# EAGLE design Xadow-GPS-v2 (EAGLE 6.4)
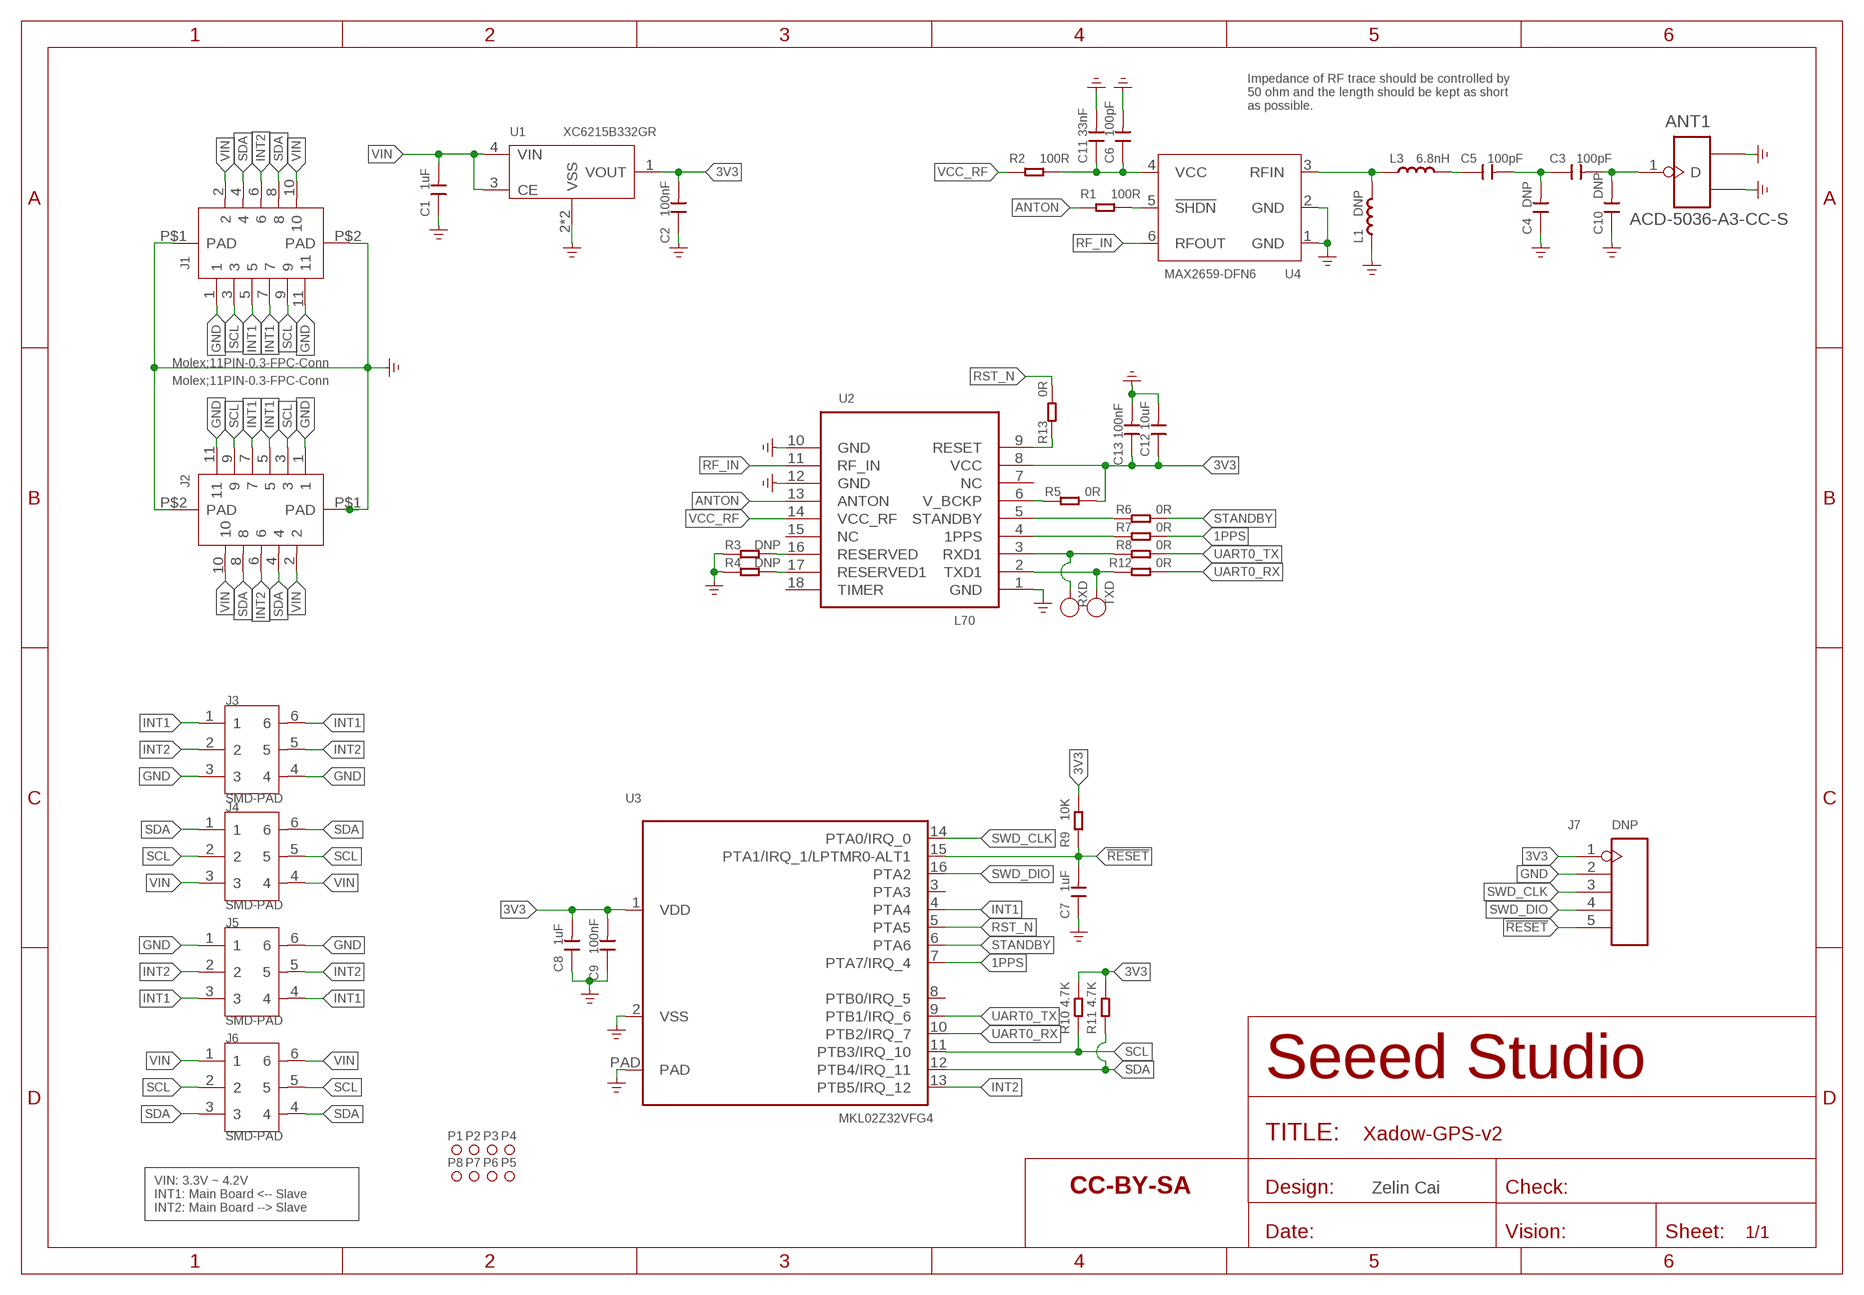
[diagram p0: schematic, sheet 1]

## Parts
ANT1  ACD-5036-A3-CC-S  ANTENNA-ACD5036  [ANT3-SMD-5.2X3.7X0.7MM]
C1  1uF  CAP-0402  [C0402]
C2  100nF  CAP-0201  [C0201]
C3  100pF  CAP-0201  [C0201]
C4  DNP  CAP-0201  [C0201]
C5  100pF  CAP-0201  [C0201]
C6  100pF  CAP-0201  [C0201]
C7  1uF  CAP-0201  [C0201]
C8  1uF  CAP-0402  [C0402]
C9  100nF  CAP-0201  [C0201]
C10  DNP  CAP-0201  [C0201]
C11  33nF  CAP-0201  [C0201]
C12  10uF  CAP-0402  [C0402]
C13  100nF  CAP-0201  [C0201]
FR  PAGE1  SEEEDSTUDIO-OPEN-SCH-FRAME  [SEEEDSTUDIO-PCB-FRAME]
J1  Molex;11PIN-0.3-FPC-Conn  FPC-CONNECTER-11P(FH35C-11S-0.3SHW(50))  [FPC11-SMD-0.3(FH35C)]
J2  Molex;11PIN-0.3-FPC-Conn  FPC-CONNECTER-11P(FH35C-11S-0.3SHW(50))  [FPC11-SMD-0.3(FH35C)]
J3  SMD-PAD  HEADER6_ROUND  [6P-DIP-2_ROUND]
J4  SMD-PAD  HEADER6  [6P-DIP-2]
J5  SMD-PAD  HEADER6_ROUND  [6P-DIP-2_ROUND]
J6  SMD-PAD  HEADER6_S3  [6P-DIP-2_S3]
J7  DNP  HEADER-5P'TEST'  [H5-SMD-2.0-TEST]
L1  DNP  INDUCTOR/FERRITE-BEAD-0201  [L0201]
L3  6.8nH  INDUCTOR/FERRITE-BEAD-0201  [L0201]
P1  MRK  MARK-1.0'ANNULAR'  [ROUND-MARK-1.0]
P2  MRK  MARK-1.0'ANNULAR'  [ROUND-MARK-1.0]
P3  MRK  MARK-1.0'ANNULAR'  [ROUND-MARK-1.0]
P4  MRK  MARK-1.0'ANNULAR'  [ROUND-MARK-1.0]
P5  MRK  MARK-1.0'ANNULAR'  [ROUND-MARK-1.0]
P6  MRK  MARK-1.0'ANNULAR'  [ROUND-MARK-1.0]
P7  MRK  MARK-1.0'ANNULAR'  [ROUND-MARK-1.0]
P8  MRK  MARK-1.0'ANNULAR'  [ROUND-MARK-1.0]
R1  100R  RES-0201  [R0201]
R2  100R  RES-0201  [R0201]
R3  DNP  RES-0201  [R0201]
R4  DNP  RES-0201  [R0201]
R5  0R  RES-0201  [R0201]
R6  0R  RES-0201  [R0201]
R7  0R  RES-0201  [R0201]
R8  0R  RES-0201  [R0201]
R9  10K  RES-0201  [R0201]
R10  4.7K  RES-0201  [R0201]
R11  4.7K  RES-0201  [R0201]
R12  0R  RES-0201  [R0201]
R13  0R  RES-0201  [R0201]
RXD  RXD  TEST-POINT'4545'  [TP-D45MIL]
TXD  TXD  TEST-POINT'4545'  [TP-D45MIL]
U1  XC6215B332GR  PMIC-XC6215-3V3  [USP4-0.6-1.2X1.6MM]
U2  L70  MOUDLE-GPS-L70-HARDWARE  [LGA18-1.1-9.7X10.1X2.5MM]
U3  MKL02Z32VFG4  CONTROLLER-MKL02ZXXVFG4  [QFN16G-0.5-3X3MM]
U4  MAX2659-DFN6  AMPLIFIER-MAX2659  [DFN6-0.5-1.5X1.2X0.72MM]

## Nets
1PPS: R7.1 U3.7(PTA7/IRQ_4)
3V3: C2.2 C8.2 C9.2 C12.1 C13.1 J7.1 R5.1 R9.2 R10.2 R11.2 U1.1(VOUT) U2.8(VCC) U3.1(VDD)
!RESET: C7.2 J7.5 R9.1 U3.15(PTA1/IRQ_1/LPTMR0-ALT1)
ANTON: R1.2 U2.13(ANTON)
GND: ANT1.2(GND1) ANT1.3(GND2) C1.1 C2.1 C4.1 C6.2 C7.1 C8.1 C9.1 C10.1 C11.2 C12.2 C13.2 J1.1 J1.11 J1.P$1(PAD) J1.P$2(PAD) J2.1 J2.11 J2.P$1(PAD) J2.P$2(PAD) J3.3 J3.4 J5.1 J5.6 J7.2 L1.1 R3.2 R4.2 U1.2(VSS) U1.PAD(VSS) U2.1(GND) U2.10(GND) U2.12(GND) U3.2(VSS) U3.PAD U4.1(GND) U4.2(GND) ; supply symbol labelled GND_POWER
INT1: J1.5 J1.7 J2.5 J2.7 J3.1 J3.6 J5.3 J5.4 U3.4(PTA4)
INT2: J1.6 J2.6 J3.2 J3.5 J5.2 J5.5 U3.13(PTB5/IRQ_12)
N$1: C3.1 C4.2 C5.2
N$2: ANT1.1(D) C3.2 C10.2
N$3: L1.2 L3.1 U4.3(RFIN)
N$4: C5.1 L3.2
N$5: R1.1 U4.5(!SHDN)
N$6: C6.1 C11.1 R2.1 U4.4(VCC)
N$7: R3.1 U2.16(RESERVED)
N$8: R4.1 U2.17(RESERVED1)
N$9: R5.2 U2.6(V_BCKP)
N$10: R6.2 U2.5(STANDBY)
N$11: R7.2 U2.4(1PPS)
N$12: R13.2 U2.9(RESET)
RF_IN: U2.11(RF_IN) U4.6(RFOUT)
RST_N: R13.1 U3.5(PTA5)
RXD1: R8.2 RXD.T U2.3(RXD1)
SCL: J1.3 J1.9 J2.3 J2.9 J4.2 J4.5 J6.2 J6.5 R10.1 U3.11(PTB3/IRQ_10)
SDA: J1.4 J1.8 J2.4 J2.8 J4.1 J4.6 J6.3 J6.4 R11.1 U3.12(PTB4/IRQ_11)
STANDBY: R6.1 U3.6(PTA6)
SWD_CLK: J7.3 U3.14(PTA0/IRQ_0)
SWD_DIO: J7.4 U3.16(PTA2)
TXD1: R12.2 TXD.T U2.2(TXD1)
UART0_RX: R12.1 U3.10(PTB2/IRQ_7)
UART0_TX: R8.1 U3.9(PTB1/IRQ_6)
VCC_RF: R2.2 U2.14(VCC_RF)
VIN: C1.2 J1.2 J1.10 J2.2 J2.10 J4.3 J4.4 J6.1 J6.6 U1.3(CE) U1.4(VIN)
Unconnected: U2.7(NC) U2.15(NC) U2.18(TIMER) U3.3(PTA3) U3.8(PTB0/IRQ_5)

## Notes on the sheet
- Impedance of RF trace should be controlled by 
  50 ohm and the length should be kept as short 
  as possible.
- Zelin Cai
- VIN: 3.3V ~ 4.2V
  INT1: Main Board <-- Slave
  INT2: Main Board --> Slave

## Library data of the parts
ANT1 = Connector-new:ANTENNA-ACD5036; MPN: ACD-5036-A3-CC-S
C1-C13 = Discrete-new:CAP: Ceramic Capacitors
FR = moudle-new:SEEEDSTUDIO-OPEN-SCH-FRAME
J1 J2 = template:FPC-CONNECTER-11P(FH35C-11S-0.3SHW(50))
J3 J5 = template:HEADER6_ROUND
J4 = template:HEADER6
J6 = Connector:HEADER6_S3
J7 = Connector-new:HEADER-5P
L1 L3 = Discrete-new:INDUCTOR/FERRITE-BEAD
P1-P8 = Discrete-new:MARK-1.0; PARTNO: DNP
R1-R13 = Discrete-new:RES
RXD TXD = Discrete-new:TEST-POINT; PARTNO: DNP
U1 = IC-new:PMIC-XC6215-3V3
U2 = moudle-new:MOUDLE-GPS-L70-HARDWARE: L70 GPS module; MPN: L70
U3 = IC-new:CONTROLLER-MKL02ZXXVFG4; MPN: MKL02ZxxVFG4
U4 = IC-new:AMPLIFIER-MAX2659: GPS/GNSS Low-Noise Amplifier; MPN: MAX2659

## Board
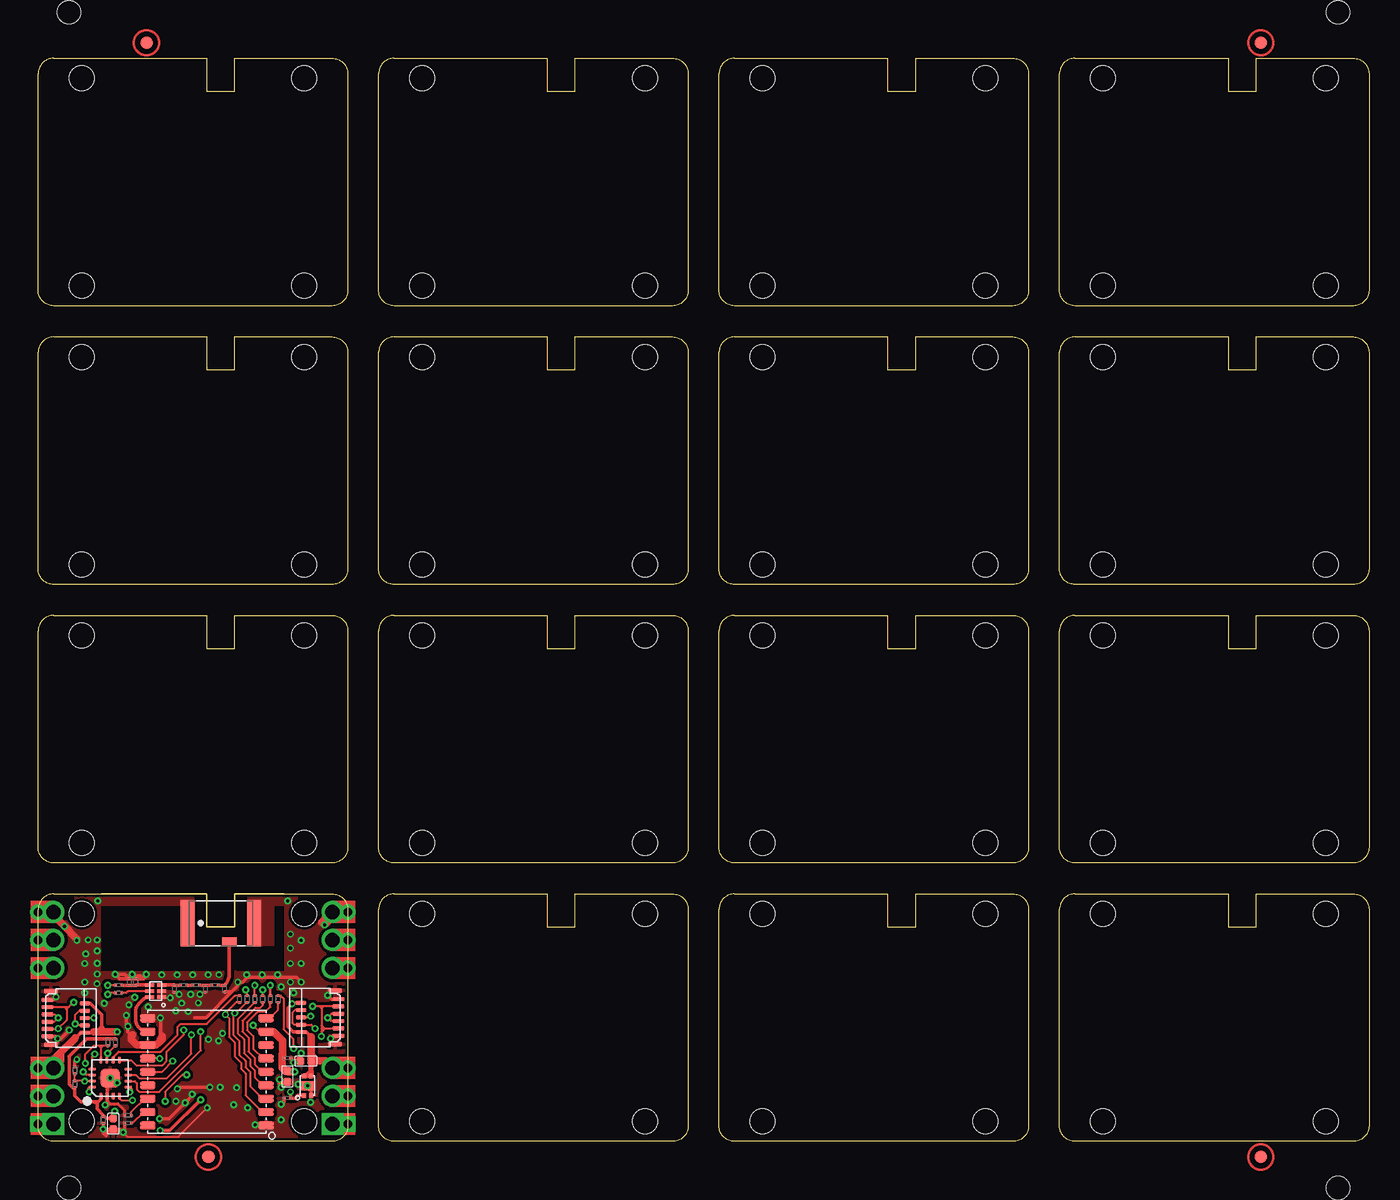
[diagram p1: board, top side]
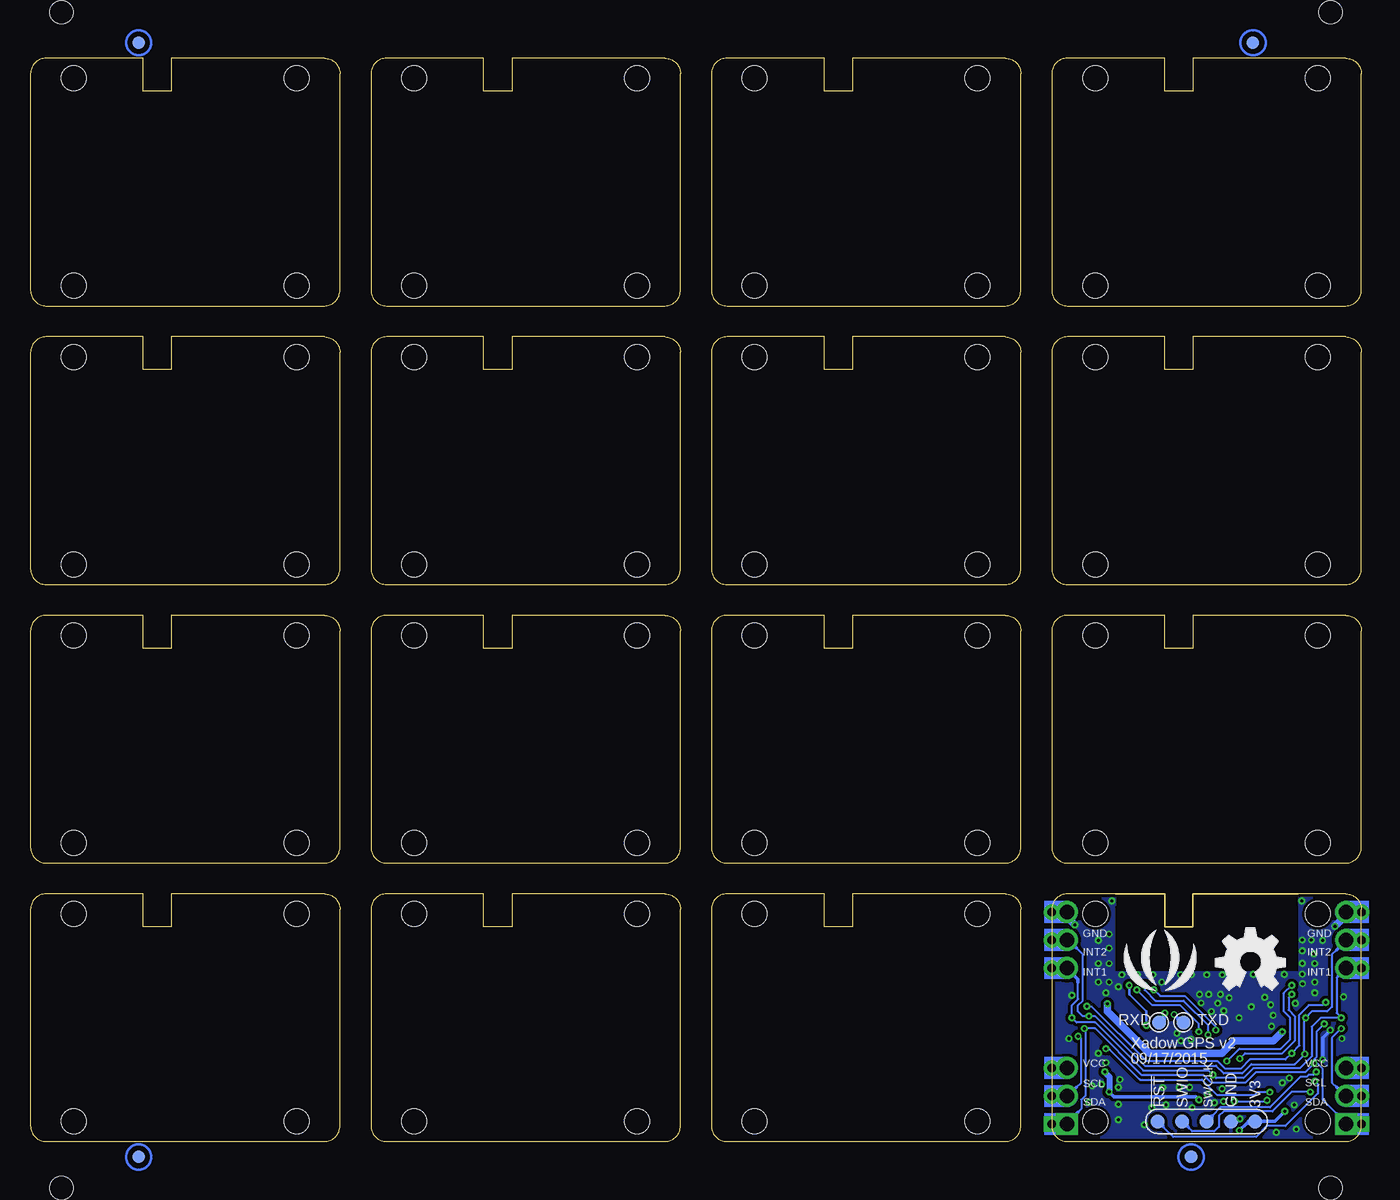
[diagram p2: board, bottom side, seen from below]

Size 109.22 x 88.9 mm. Coordinates in mm from the lower left corner, seen from the top.
Outline: 600 segments
Copper layers (1*16): Top 0.035mm / dielectric 1.5mm / Bottom 0.035mm
Design rules "SeeedStudio_2layer_DRU_no_angle_20140221 *": minimum track width 1mil, minimum drill 10mil, track to track 6mil, track to pad 6mil, pad to pad 6mil, via to via 6mil, smd to smd 0mil, copper to edge 10mil, drill to drill 10mil, minimum pad ring 10mil, minimum via ring 6mil, stop-mask expansion 2mil, vias tented up to drill 25mil, thermal gap 10mil
Holes 2.03 mm at 21.84,1.65 3.56,18.67 21.84,18.67 3.56,1.65 3.56,18.67 21.84,18.67 21.84,1.65 3.56,1.65 49.78,1.65 49.78,18.67 31.5,18.67 31.5,1.65 21.84,24.51 21.84,41.53 3.56,41.53 3.56,24.51 49.78,24.51 49.78,41.53 31.5,41.53 31.5,24.51 77.72,1.65 77.72,18.67 59.44,18.67 59.44,1.65 105.66,1.65 105.66,18.67 87.38,18.67 87.38,1.65 77.72,24.51 77.72,41.53 59.44,41.53 59.44,24.51 105.66,24.51 105.66,41.53 87.38,41.53 87.38,24.51 21.84,47.37 21.84,64.39 3.56,64.39 3.56,47.37 49.78,47.37 49.78,64.39 31.5,64.39 31.5,47.37 21.84,70.23 21.84,87.25 3.56,87.25 3.56,70.23 49.78,70.23 49.78,87.25 31.5,87.25 31.5,70.23 77.72,47.37 77.72,64.39 59.44,64.39 59.44,47.37 105.66,47.37 105.66,64.39 87.38,64.39 87.38,47.37 77.72,70.23 77.72,87.25 59.44,87.25 59.44,70.23 105.66,70.23 105.66,87.25 87.38,87.25 87.38,70.23
Holes 1.91 mm at 2.54,-3.81 106.68,-3.81 106.68,92.71 2.54,92.71
bRestrict: 2 lines

### Footprints (pad centres in the part's own frame; a part is rotated, then mirrored left to right if it is on the bottom)
ANT3-SMD-5.2X3.7X0.7MM = smd 0.75 x 1.2: 1 1.525,0.7 | smd 3.8 x 1.15: 2 0,2.725; 3 0,-2.725
C0402 = smd 0.635 x 0.635: 1 0,0.445; 2 0,-0.445
C0201 = smd 0.279 x 0.318: 1 -0.279,0; 2 0.279,0
FPC11-SMD-0.3(FH35C) = smd 0.3 x 1: 1 -1.5,-3.075; 3 -0.9,-3.075; 5 -0.3,-3.075; 7 0.3,-3.075; 9 0.9,-3.075; 11 1.5,-3.075 | smd 0.3 x 0.85: 2 -1.2,0; 4 -0.6,0; 6 0,0; 8 0.6,0; 10 1.2,0 | smd 0.4 x 1.15: P$1 2.2,-2.8; P$2 -2.2,-2.8
6P-DIP-2_ROUND = drill 0.7 pad 1.27: 1 -2.3,0; 2 0,0; 3 2.3,0 | drill 1.2 pad 1.8: 4 2.3,1.25; 5 0,1.25; 6 -2.3,1.25
6P-DIP-2 = drill 0.7 pad 1.27 square: 1 -2.3,0 | drill 0.7 pad 1.27: 2 0,0; 3 2.3,0 | drill 1.2 pad 1.8: 4 2.3,1.25; 5 0,1.25 | drill 1.2 pad 1.8 square: 6 -2.3,1.25
6P-DIP-2_S3 = drill 0.7 pad 1.27: 1 -2.3,0; 2 0,0 | drill 0.7 pad 1.27 square: 3 2.3,0 | drill 1.2 pad 1.8 square: 4 2.3,1.25 | drill 1.2 pad 1.8: 5 0,1.25; 6 -2.3,1.25
H5-SMD-2.0-TEST = smd 1.143 x 1.143: 1 0,4; 2 0,2; 3 0,0; 4 0,-2; 5 0,-4
L0201 = smd 0.279 x 0.318: 1 -0.279,0; 2 0.279,0
ROUND-MARK-1.0 = smd 1.016 x 1.016: P$1 0,0
R0201 = smd 0.279 x 0.318: 1 -0.279,0; 2 0.279,0
TP-D45MIL = smd 1.143 x 1.143: T 0,0
USP4-0.6-1.2X1.6MM = smd 0.36 x 0.4: 1 -0.3,-0.8; 2 0.3,-0.8; 3 0.3,0.8; 4 -0.3,0.8 | smd 1 x 0.7: PAD 0,0
LGA18-1.1-9.7X10.1X2.5MM = smd 1.27 x 0.635: 1 4.85,-4.4; 2 4.85,-3.3; 3 4.85,-2.2; 4 4.85,-1.1; 5 4.85,0; 6 4.85,1.1; 7 4.85,2.2; 8 4.85,3.3; 9 4.85,4.4; 10 -4.85,4.4; 11 -4.85,3.3; 12 -4.85,2.2; 13 -4.85,1.1; 14 -4.85,0; 15 -4.85,-1.1; 16 -4.85,-2.2; 17 -4.85,-3.3; 18 -4.85,-4.4
QFN16G-0.5-3X3MM = smd 0.6 x 0.25: 1 -1.475,0.75; 2 -1.475,0.25; 3 -1.475,-0.25; 4 -1.475,-0.75; 9 1.475,-0.75; 10 1.475,-0.25; 11 1.475,0.25; 12 1.475,0.75 | smd 0.25 x 0.6: 5 -0.75,-1.475; 6 -0.25,-1.475; 7 0.25,-1.475; 8 0.75,-1.475; 13 0.75,1.475; 14 0.25,1.475; 15 -0.25,1.475; 16 -0.75,1.475 | smd 1.6 x 1.6: PAD 0,0
DFN6-0.5-1.5X1.2X0.72MM = smd 0.3 x 0.75: 1 -0.5,-0.5; 2 0,-0.5; 3 0.5,-0.5; 4 0.5,0.5; 5 0,0.5; 6 -0.5,0.5

### Placement (x,y rotation side)
ANT1  14.99,17.92 270 top
C1  21.97,6.6 90 top
C2  20.45,3.56 0 top
C3  14.5,12.83 0 top
C4  13.72,12.55 90 top
C5  12.95,12.83 0 top
C6  8,13.08 90 top
C7  3.01,5.84 270 top
C8  6.16,1.46 180 top
C9  5.33,1.78 90 top
C10  15.29,12.55 90 top
C11  7.49,13.08 90 top
C12  20.45,5.33 0 top
C13  20.45,6.86 0 top
FR  12.32,-30.1 0 top  (outside the outline)
J1  21.56,10.19 90 top
J2  3.84,10.13 270 top
J3  25.4,16.54 90 top
J4  25.4,3.73 90 top
J5  0,16.54 270 top
J6  0,3.73 270 top
J7  12.7,1.65 270 bottom
L1  11.18,12.55 90 top
L3  11.94,12.83 0 top
P1  13.97,-1.27 0 top
P2  13.97,-1.27 0 bottom
P3  8.89,90.17 0 top
P4  8.89,90.17 0 bottom
P5  100.33,-1.27 0 top
P6  100.33,-1.27 0 bottom
P7  100.33,90.17 0 top
P8  100.33,90.17 0 bottom
R1  6.6,12.19 180 top
R2  6.6,12.83 180 top
R3  7.37,2.16 180 top
R4  7.37,1.52 180 top
R5  19.05,11.68 270 top
R6  18.41,11.68 270 top
R7  17.78,11.68 270 top
R8  17.14,11.68 270 top
R9  3.01,4.7 270 top
R10  6.35,8.13 90 top
R11  5.71,8.13 90 top
R12  16.51,11.68 270 top
R13  19.68,11.68 270 top
RXD  16.61,9.78 180 bottom
TXD  14.61,9.78 180 bottom
U1  22.1,4.57 0 top
U2  13.84,5.71 0 top
U3  5.91,5.21 90 top
U4  9.64,12.34 90 top
U$19  [OSHW_FILLX200_NOTEXT]  11.94,12.45 0 bottom
U$21  [SEEED-SILK-280*268MIL]  16.51,14.1 0 bottom

### Tracks (layer width: path | path; a pad name or v marks a point on that pad's centre or on a via)
1PPS  (via drill 0.25 pad 0.51)
  Top 0.152: U3.7 8.02,5.46 8.31,5.17 10.53,5.17 12.57,7.21 v12.57,8.76 | R7.1 v17.78,12.83
  Bottom 0.152: v17.78,12.83 17.78,12.45 16.89,11.56 14.61,11.56 12.57,9.53 v12.57,8.76
3V3  (via drill 0.25 pad 0.51)
  Top 0.203: R5.1 v19.05,12.83 | U2.8 18.16,9.02 v17.65,9.53
  Top 0.305: v20.7,4.06 20.73,4.04 C2.2 21.08,3.56 21.3,3.77 U1.1 | 20.51,5.71 C12.1 | R10.2 R11.2 3.96,8.41 2.54,6.99 2.54,4.7 2.82,4.42 R9.2 3.01,3.75 3.48,3.28 4.6,3.28 | v13.34,3.43 10.81,0.9 v10.01,0.9 | U2.8 | 4.83,3.05 4.83,2.67 5.33,2.16 C9.2 5.44,2.06 5.59,1.91 C8.2 6.16,2.38 v6.27,2.49 | 4.83,3.05 4.83,3.17 4.93,3.28 | 4.93,3.28 5.16,3.5 U3.1 | 4.6,3.28 4.93,3.28 | 4.6,3.28 4.83,3.05 | 20.07,7.24 20.07,7.16 20.07,6.96 C13.1 | C13.1 19.94,6.86 19.94,7.24 | C13.1 20.17,6.88 20.24,6.96 20.24,7.21 20.19,7.26
  Top 0.61: U2.8 19.31,9.02 20.07,8.26 20.07,7.24 | C12.1 20.31,5.78 20.04,6.04 20.04,7.14 20.07,7.16 | 20.51,5.71 v21.06,5.71
  Bottom 0.203: v19.05,12.83 19.05,12.06 17.65,10.67 v17.65,9.53
  Bottom 0.305: v13.34,3.43 13.59,3.68 20.32,3.68 v20.7,4.06 | v6.27,2.49 7.11,1.65 J7.1 9.26,1.65 9.41,1.49 | 9.41,1.49 v10.01,0.9 | 9.41,1.49 8.67,1.49 8.64,1.52
  Bottom 0.508: 20.7,4.12 v20.7,4.06 20.65,4.12 20.65,5.28 21.08,5.71 v21.06,5.71
!RESET  (via drill 0.25 pad 0.51)
  Top 0.152: U3.15 v3.81,4.96 v3.81,4.95 3.79,4.98 R9.1 C7.2
  Bottom 0.152: 16.19,1.14 15.43,0.38 8.64,0.38 7.75,1.27 6.22,1.27 3.56,3.94 3.56,4.7 v3.81,4.95 | 16.19,1.14 J7.5 | 16.19,1.14 16.26,1.65 | 16.19,1.14 16.76,1.4
ANTON  (via drill 0.25 pad 0.51)
  Top 0.152: U2.13 9.02,6.79 9.02,6.73 8.89,6.86 9.92,6.86 v9.97,6.81 | R1.2 5.84,12.19 v5.71,12.06
  Bottom 0.152: v9.97,6.81 9.54,7.24 6.48,7.24 5.46,8.26 5.46,10.29 5.97,10.79 5.97,11.81 v5.71,12.06
GND  (via drill 0.25 pad 0.51)
  Top 0.152: v6.99,0.76 6.99,0.71 7.32,0.38 11.49,0.38 v13.88,2.77
  Top 0.254: R3.2 7.09,2.56 6.54,3.11 5.91,3.11 | 5.91,3.11 5.7,3.11 5.69,3.1 5.69,3.07 5.71,3.05 5.66,3.05 5.64,3.07 5.64,3.05 5.61,3.02 5.59,3.02 | 5.91,3.11 5.71,3.3
  Top 0.305: v5.33,1.02 C8.1 6.73,1.02 v6.99,0.76 7.09,0.86 R4.2 | U3.PAD 5.66,4.96 U3.2 5.66,3.14 v5.51,3 | J2.11 1.4,8.63 v1.59,8.45 | J2.P$1 1.33,7.93 1.59,8.19 v1.59,8.45 | J2.1 1.22,11.63 v1.46,11.87 1.46,12.13 1.25,12.34 J2.P$2 | 24.15,18.43 J3.4 J3.3 | J1.1 24.24,8.69 v24,8.45 24,8.13 24.15,7.99 J1.P$2 | v19.94,4.45 20.38,4.89 C12.2 20,4.89 | U1.2 22.4,4.14 | 22.4,4.14 22.4,4.27 U1.PAD | v3.17,16.51 3.17,16.64 | C7.1 3.01,6.57 v3.17,6.73 | v1.59,8.45 1.84,8.45 v2.54,9.14 | J1.11 24.07,11.69 v23.75,12 23.75,12.06 24.07,12.38 J1.P$1 | 20.99,6.51 21.08,6.6 C1.1 21.53,7.18 v21.59,7.24 | 20.99,6.51 v20.95,6.48 | C13.2 20.73,6.77 20.99,6.51 | v10.03,10.16 10.03,8.38 9.57,7.92 9.15,7.92 U2.12 | v21.59,13.08 21.21,13.46 17.14,13.46 16.76,13.08 v16.38,13.08 16.38,12.77 15.88,12.27 | C2.1 20.17,3.28 v19.94,3.05 | 22.4,4.14 22.1,4.45 | C6.2 C11.2 | C11.2 7.49,13.49 v7.72,13.72 | C6.2 8,13.46 7.75,13.72 | C10.1 15.88,12.27 | C11.2 6.71,13.36 6.35,13.72 7.11,13.72 7.24,13.59 7.37,13.59 7.37,13.46 7.49,13.34 | C6.2 8.66,13.36 8.76,13.46 8.26,13.46 8.13,13.59 8.38,13.59 | 7.68,8.7 7.37,9.02 v7.37,9.46 7.24,9.59 v7.24,10.35 | v5.33,1.02 5.33,0.89 | 5.33,0.89 5.51,0.71 6.91,0.71 6.99,0.79 | C9.1 v5.33,1.02 | 5.33,0.89 5.33,0.69 5.56,0.46 | 20,4.89 v19.81,5.08 19.81,4.7 20,4.89 | 15.88,12.27 15.88,12.26 13.78,10.16 12.83,10.16 | v14.1,4.45 11.56,4.45 v11.43,4.32 | v9.96,1.85 10.74,1.85 v12.06,3.17 12.64,3.75 v12.64,3.87
  Top 0.61: J5.6 1.25,18.56 v2.16,17.65 3.17,16.64 | 24.15,18.43 v23.5,17.78 23.5,18.29 23.62,18.41 | U2.12 8.09,7.92 7.62,8.38 7.62,8.64 7.75,8.76 | 9.15,7.92 9.69,7.92 10.03,8.26 10.03,8.38 10.16,8.38 10.16,8.64 | 23.62,18.41 24.13,18.92 | 23.62,18.41 23.62,18.34 23.27,17.98
  Bottom 0.305: v2.54,9.14 3.17,8.51 v3.17,6.73 | J7.2 10.16,1.65 v9.96,1.85
  Bottom 0.61: v2.16,17.65 1.27,18.54 1.27,18.82 J5.6 | v23.5,17.78 24.15,18.43 J3.4
  other vias: 22.1,4.57 4.83,12.95 5.91,5.21 6.48,4.83 13.97,8.38 14.92,4.45 15.13,8.89 17.82,1.37 11.56,12.06 3.81,14.61 9.02,11.05 19.94,1.78 20.7,13.08 20.7,14.61 21.59,16.51 3.81,12.19 12.32,10.67 21.59,14.61 3.81,13.08 4.85,15.65 4.85,14.63 4.85,13.74 6.32,13.72 8.86,13.72 10.13,13.69 11.4,13.69 12.67,13.69 13.94,13.69 14.83,13.69 17.12,13.69 18.39,13.69 19.66,13.69 20.7,15.88 7.44,11.21 7.92,11.82 13.14,11.37 20.7,17.02 10.85,11.79 12.51,12.06 4.88,19.74 20.47,19.74 5.41,11.33 11.79,11.35 11.28,10.72 14.8,8.26 20.95,12.19 19.94,12.7 16.04,3.02 22.35,3.23 21.34,4.7 3.9,15.39 4.85,16.54 4.09,16.54 17.18,2.77 16.29,4.42 13.27,12.06 11.3,3.3
  pour Bottom (isolate 0.254, rank 6): -0.64,20.95 26.04,20.95 26.04,-0.64 -0.64,-0.64
  pour Top (isolate 0.254, rank 6): -0.64,20.95 26.04,20.95 26.04,-0.64 -0.64,-0.64
  pour Top (no thermals): 20.95,16 3.05,16 3.05,20.32 20.95,20.32
  pour Top (no thermals): 4.6,16 5.18,16 5.18,14.02 15.24,14.02 15.24,13.69 4.6,13.69
  pour Top (no thermals): 16.1,14.02 16.1,13.61 20.65,13.61 20.65,16.03 20.19,16.03 20.19,14.02
  pour Bottom (no thermals): 4.6,20.32 5.18,20.32 5.18,14.02 15.06,14.02 15.06,13.69 4.6,13.69
  pour Bottom (no thermals): 14.91,14.02 14.91,13.61 20.65,13.61 20.65,20.32 20.19,20.32 20.19,14.02
  pour Top (isolate 0.254, no thermals): 8.89,9.78 10.92,9.78 10.92,12.45 9.78,12.45 9.78,11.43 8.51,11.43 8.51,9.78
  pour Top (isolate 0.254, no thermals): 17.78,1.65 19.68,1.65 19.68,2.16 20.45,2.16 20.45,0.38 17.78,0.38
  pour Top (isolate 0.254, no thermals): 19.81,4.19 23.11,4.19 23.11,5.21 19.56,5.21 19.56,4.19
  pour Top (isolate 0.254, no thermals): 10.79,12.45 15.62,12.45 15.62,9.91 10.79,9.91
INT1  (via drill 0.25 pad 0.51)
  Top 0.152: J2.5 0.78,10.41 1.4,10.41 v1.65,10.16 1.33,9.84 J2.7 | U3.4 6.66,3.5 | U3.4 6.66,3.63 | U3.4 6.66,3.54 6.82,3.37 v7.73,3.37 | J1.5 24.02,9.88 v23.75,10.16 24.07,10.48 J1.7 | v10.41,3.3 10.41,4.06 11.84,5.49 12.17,5.49 v12.19,5.46
  Top 0.305: J3.6 J3.1
  Bottom 0.152: v7.73,3.37 7.8,3.3 v10.41,3.3 | 1.91,13.59 2.03,13.46 2.03,10.54 v1.65,10.16 3.32,10.16 4.06,9.42 4.06,6.99 5.02,6.03 8.83,6.03 9.65,5.21 11.94,5.21 v12.19,5.46 12.57,5.84 17.91,5.84 21.84,9.78 23.37,9.78 v23.75,10.16 23.75,11.18 23.24,11.68 23.24,13.08
  Bottom 0.305: J5.4 | J5.4 1.65,13.83 1.66,13.83 1.91,13.59 | J5.4 J5.3 | 23.24,13.08 23.24,13.33 J3.6
INT2  (via drill 0.25 pad 0.51)
  Top 0.152: J2.6 4.55,10.13 v4.57,10.16 | J1.6 22.25,10.19 v22.35,10.29 | U3.13 4.43,6.97 v4.64,7.18
  Top 0.305: 24.03,16.54 J3.5 J3.2
  Bottom 0.152: 2.03,15.75 2.41,15.37 2.41,11.05 2.79,10.67 4.06,10.67 v4.57,10.16 4.7,10.03 4.7,7.24 v4.64,7.18 5.46,6.35 9.02,6.35 9.78,5.59 11.3,5.59 11.94,6.22 17.78,6.22 21.84,10.29 v22.35,10.29 22.86,10.29 23.24,10.67 23.24,11.18 22.86,11.56 22.86,15.37 23.37,15.88
  Bottom 0.305: 2.03,15.75 J5.5 J5.2 | 23.37,15.88 24.03,16.54 J3.5
N$1
  Top 0.305: C5.2 C4.2 C3.1
N$2
  Top 0.305: ANT1.1 15.67,16.38 15.67,13.71 arc-45 15.32,12.85 C10.2 C3.2
N$3
  Top 0.305: U4.3 11.18,12.84 L1.2 L3.1
N$4
  Top 0.305: L3.2 C5.1
N$5
  Top 0.152: U4.5 7.39,12.34 7.24,12.19 R1.1
N$6
  Top 0.305: U4.4 8.04,12.84 C6.1 C11.1 6.91,12.8 R2.1
N$7
  Top 0.152: U2.16 8.72,3.52 7.64,2.44 R3.1
N$8
  Top 0.152: U2.17 8.64,2.42 7.75,1.52 R4.1
N$9
  Top 0.152: R5.2 19.05,11.05 18.67,10.67 18.03,10.67 17.14,9.78 17.14,9.14 17.65,8.64 17.65,7.62 18.46,6.82 U2.6
N$10
  Top 0.152: U2.5 18.41,5.71 17.78,6.35 17.78,6.86 17.27,7.37 17.27,8.51 16.76,9.02 16.76,9.91 17.84,10.99 18.22,10.99 18.41,11.18 R6.2
N$11
  Top 0.152: U2.4 18.41,4.62 17.78,5.25 17.78,5.84 17.4,6.22 17.4,6.73 16.89,7.24 16.89,8.38 16.38,8.89 16.38,10.01 R7.2
N$12
  Top 0.152: U2.9 18.67,10.14 19.03,10.14 19.68,10.79 R13.2
RF_IN
  Top 0.305: U2.11 8.64,9.02 8.22,9.43 arc-45 8,9.97 8,10.72 arc-45 8.24,11.28 8.61,11.65 arc-45 9.06,11.84 U4.6
RST_N  (via drill 0.25 pad 0.51)
  Top 0.152: U3.5 7.52,4.46 7.66,4.32 7.66,4.19 v7.52,4.05 | R13.1 19.91,11.96 20.13,11.75 20.13,9.21 20.95,8.38 v20.95,7.62
  Bottom 0.152: v20.95,7.62 20.7,7.62 18.16,5.08 13.08,5.08 11.81,3.81 8.76,3.81 8.52,4.05 v7.52,4.05
RXD1  (via drill 0.25 pad 0.51)
  Top 0.152: U2.3 18.41,3.52 17.4,4.53 17.4,5.71 17.02,6.1 17.02,6.6 16.51,7.11 16.51,8.26 16,8.76 16,10.41 v16.13,10.54 16.26,10.54 17.12,11.4 R8.2
  Bottom 0.152: v16.13,10.54 16.13,10.41 | 16.13,10.41 16.13,10.29 | 16.13,10.29 16.13,10.26 | 16.13,10.26 RXD.T | 16.13,10.26 16.13,9.65 | 16.13,10.29 16.38,10.16 | 16.13,10.41 16.51,10.16
SCL  (via drill 0.25 pad 0.51)
  Top 0.152: 23.24,9.27 23.5,9.27 | 23.5,9.27 24.62,9.27 J1.3 | R10.1 6.33,7.85 v5.71,7.24 5.66,7.18 U3.11 | 2.33,11.04 2.53,11.04 | 2.53,11.04 v2.92,11.43 | J2.9 1.61,9.23 v1.65,9.27 2.33,9.95 2.33,10.84 | 2.33,11.04 2.33,10.84 | 2.33,10.84 2.53,11.04 | J2.3 2.13,11.04 | 2.13,11.04 2.33,10.84 | 2.13,11.04 2.33,11.04 | 23.24,11.09 23.24,10.92 | 23.24,10.92 23.24,9.53 | 23.24,9.53 23.24,9.27 | 23.24,9.27 23.24,9.02 | 23.24,9.02 v23.24,8.64 | 23.5,9.27 23.24,9.53 | 23.5,9.27 23.24,9.02 | J1.9 23.24,11.09 | 23.24,11.09 v22.52,11.09 | 23.24,10.92 23.11,11.05 | 23.24,10.92 23.37,11.05
  Bottom 0.152: 23.37,4.45 22.99,4.83 22.99,8.38 v23.24,8.64 | 2.03,4.45 2.41,4.83 2.41,8.51 v1.65,9.27 | v22.52,11.09 22.13,11.09 17.65,6.6 11.81,6.6 11.18,5.97 9.91,5.97 9.14,6.73 6.22,6.73 v5.71,7.24 5.08,7.87 5.08,10.41 4.32,11.18 3.17,11.18 v2.92,11.43
  Bottom 0.305: 23.37,4.45 24.08,3.73 J4.5 J4.2 | 2.03,4.45 1.27,3.68 1.27,3.71 J6.5 J6.2
SDA  (via drill 0.25 pad 0.51)
  Top 0.152: R11.1 5.21,7.85 | J2.4 3.37,10.73 3.05,10.41 v3.05,9.65 3.17,9.54 J2.8 | U3.12 5.16,7.7 | 5.16,7.7 5.16,7.8 5.21,7.85 | 5.21,7.85 4.98,7.85 | 4.98,7.85 4.55,7.85 3.87,7.18 v3.87,6.41 | 5.16,7.7 5.27,7.81 | 5.16,7.7 5.13,7.7 4.98,7.85 | J1.8 21.07,10.79 20.89,10.6 20.89,9.72 21.02,9.59 J1.4 22.42,9.59 v22.73,9.27
  Bottom 0.152: 2.03,2.29 3.17,3.43 3.17,5.97 3.62,6.41 v3.87,6.41 | v3.87,6.41 4.57,5.71 8.64,5.71 9.53,4.83 12.32,4.83 12.95,5.46 18.03,5.46 21.84,9.27 v22.73,9.27 22.61,9.14 22.61,3.81 22.99,3.43 22.99,2.67 23.24,2.41 | v3.87,6.41 3.87,6.73 3.68,6.92 3.68,9.02 v3.05,9.65
  Bottom 0.305: 23.24,2.41 24.15,1.5 J4.6 J4.1 | 2.03,2.29 1.25,1.5 J6.4 J6.3
STANDBY  (via drill 0.25 pad 0.51)
  Top 0.152: U3.6 7.92,4.96 8.09,4.79 8.09,4.28 8.31,4.06 9.93,4.06 13.34,7.47 v13.34,9.02 | v18.41,12.45 R6.1
  Bottom 0.152: v18.41,12.45 17.14,11.18 14.86,11.18 13.34,9.65 v13.34,9.02
SWD_CLK  (via drill 0.25 pad 0.51)
  Top 0.152: v3.68,5.71 3.94,5.46 U3.14
  Bottom 0.152: v3.68,5.71 3.94,5.46 4.32,5.46 4.45,5.33 4.95,5.33 7.49,2.79 11.56,2.79 12.19,2.16 | 12.19,2.16 J7.3 | 12.19,2.16 12.32,1.52 | 12.19,2.16 12.83,2.03
SWD_DIO  (via drill 0.25 pad 0.51)
  Top 0.152: U3.16 4.2,4.46 4.06,4.32 4.06,4.19 v4.19,4.06
  Bottom 0.152: v4.19,4.06 5.71,4.06 7.3,2.48 11.3,2.48 11.68,2.1 11.68,1.21 12.06,0.83 13.87,0.83 14.13,1.08 | 14.13,1.08 J7.4 | 14.13,1.08 14.35,1.65 | 14.13,1.08 14.86,1.4
TXD1  (via drill 0.25 pad 0.51)
  Top 0.152: R12.2 16.23,11.4 15.37,10.54 v15.37,10.41 15.67,10.11 15.67,8.59 16.13,8.13 16.13,6.99 16.64,6.48 16.64,5.97 17.02,5.59 17.02,3.81 18.41,2.41 18.42,2.42 U2.2
  Bottom 0.152: TXD.T 14.73,9.78 15.24,10.29 | 15.24,10.29 v15.37,10.41 | 15.24,10.29 14.73,10.16 | 15.24,10.29 14.99,9.65
UART0_RX
  Top 0.152: U3.10 6.16,6.92 6.6,7.37 10.03,7.37 11.43,8.76 11.43,9.4 11.68,9.65 13.84,9.65 16.13,11.94 16.48,11.94 R12.1
UART0_TX  (via drill 0.25 pad 0.51)
  Top 0.152: U3.9 7.62,6.68 8.04,6.26 10.2,6.26 10.54,6.6 10.54,7.37 11.94,8.76 v11.94,9.14 | R8.1 17.14,12.32 v17.02,12.45
  Bottom 0.152: v17.02,12.45 16.51,11.94 14.48,11.94 11.94,9.4 v11.94,9.14
VCC_RF  (via drill 0.25 pad 0.51)
  Top 0.152: R2.2 v5.71,12.83 | U2.14 10.16,5.71 v11.05,6.6
  Bottom 0.152: v5.71,12.83 6.35,12.19 6.35,10.67 5.84,10.16 5.84,8.38 6.6,7.62 10,7.62 10.46,7.16 10.54,7.08 11.02,6.6 v11.05,6.6
VIN  (via drill 0.25 pad 0.51)
  Top 0.152: 4.83,9.14 5.21,9.53 5.59,9.14
  Top 0.305: 22.42,8.57 22,8.98 J1.2 20.92,8.98 20.51,9.4 20.51,10.99 v20.83,11.3 20.91,11.38 J1.10 | 5.21,9.02 5.21,9.53 5.21,10.4 4.27,11.34 J2.2 | 6.39,8.94 v6.48,9.02 | 2.98,8.45 3.47,8.94 J2.10 4.49,8.94 4.57,9.02
  Top 0.406: U1.4 U1.3 22.42,5.39 22.42,5.78 | C1.2 22.42,6.16 | 22.42,5.78 22.42,6.16 | 22.42,6.16 22.73,6.48 | 22.42,5.78 22.1,5.46
  Top 0.61: 22.86,6.6 C1.2 22.42,8.57 | 22.86,6.6 23.58,6.6 J4.4 J4.3 | J6.1 J6.6 1.25,6.71 1.78,7.24 | 1.78,7.24 2.98,8.45 3.05,8.51 | 1.78,7.24 1.84,7.24 1.84,6.6 | 22.86,6.6 22.48,6.99 | 4.57,9.02 5.21,9.02 v6.48,9.02
  Bottom 0.61: v6.48,9.02 7.24,8.26 10.41,8.26 11.43,7.24 17.4,7.24 20.83,10.67 v20.83,11.3

### Text on the board
bPlace: GND | GND | INT2 | INT2 | INT1 | INT1 | Xadow GPS v2 | VCC | 09/17/2015 | VCC | SCL | SCL | SDA | 3V3 | GND | SWCLK | SWIO | !RST | SDA